# EAGLE board hackeeg-shield (EAGLE 9.6.2)
PCB Matrix Packages
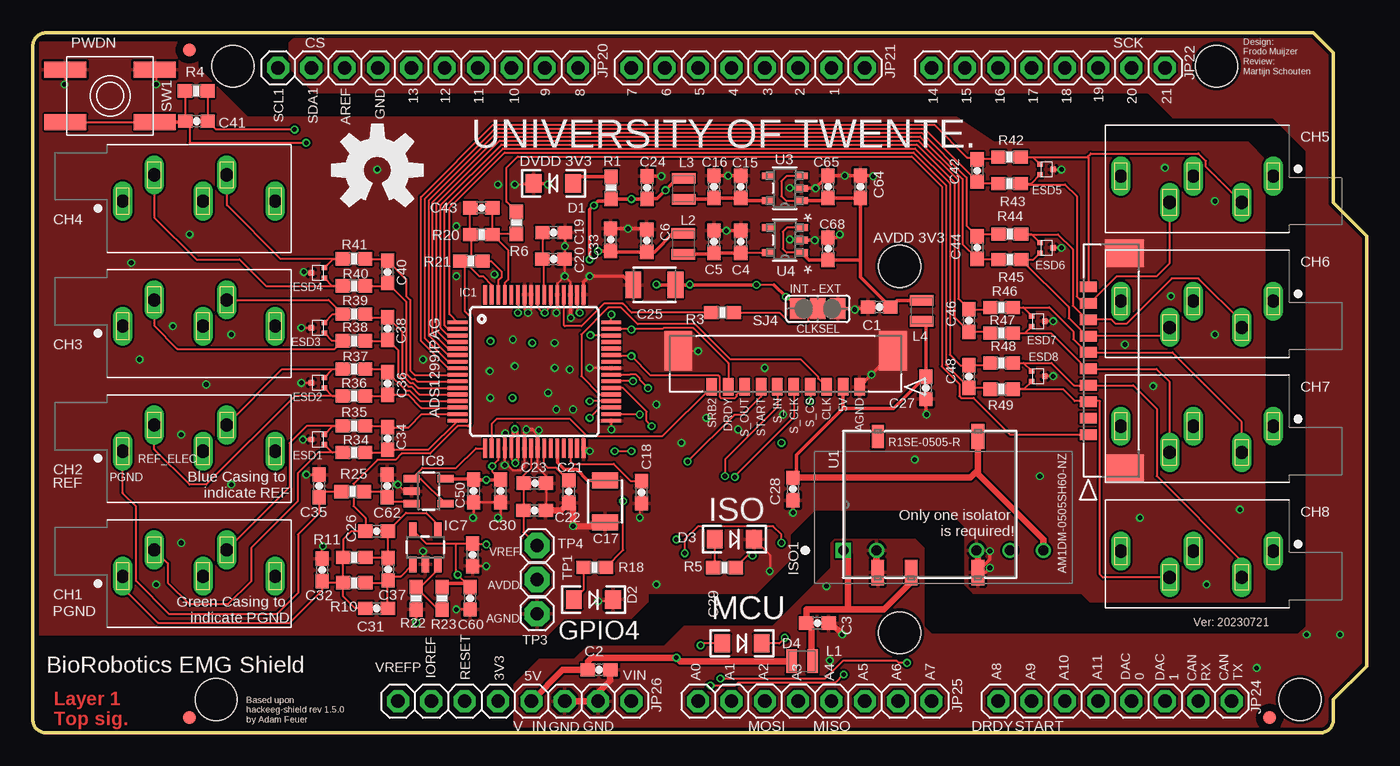
[diagram p4: board, top side]
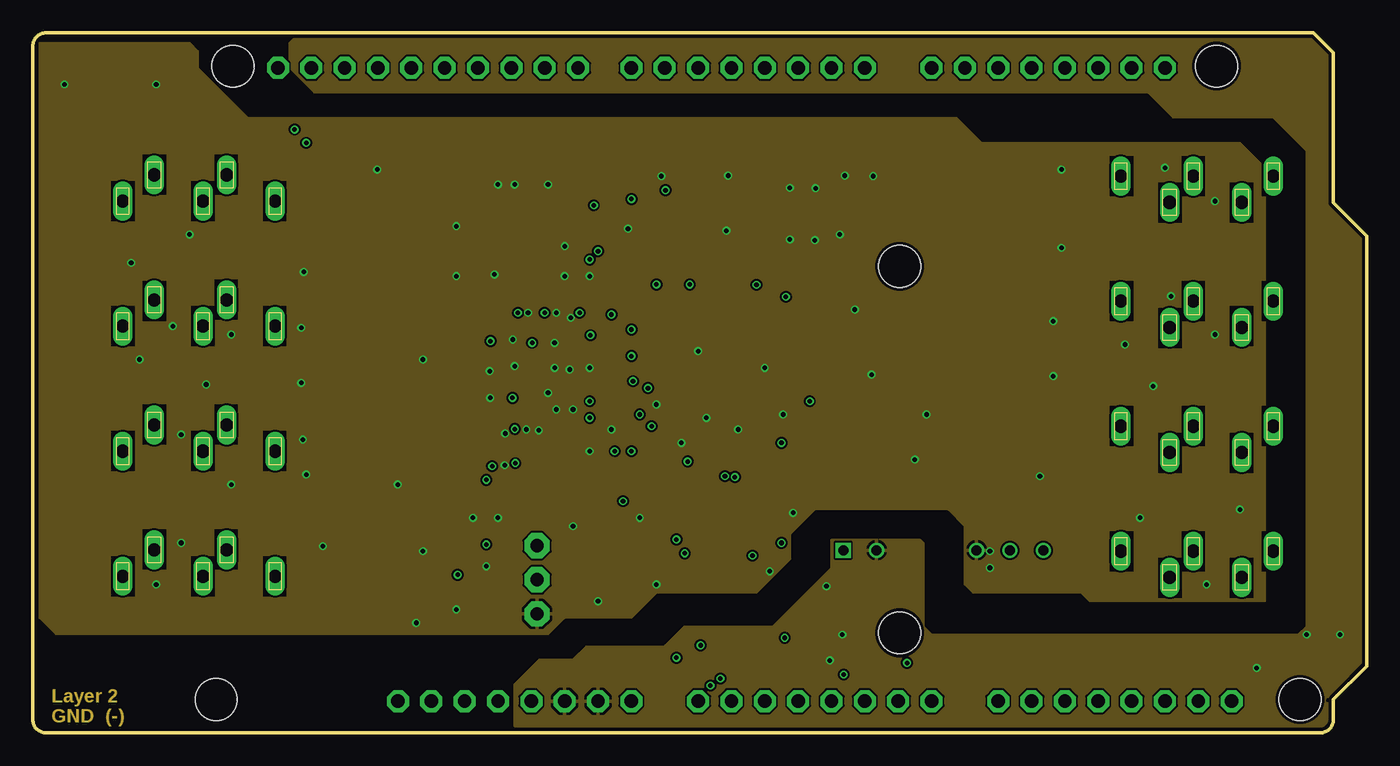
[diagram p5: board, inner layer AGND]
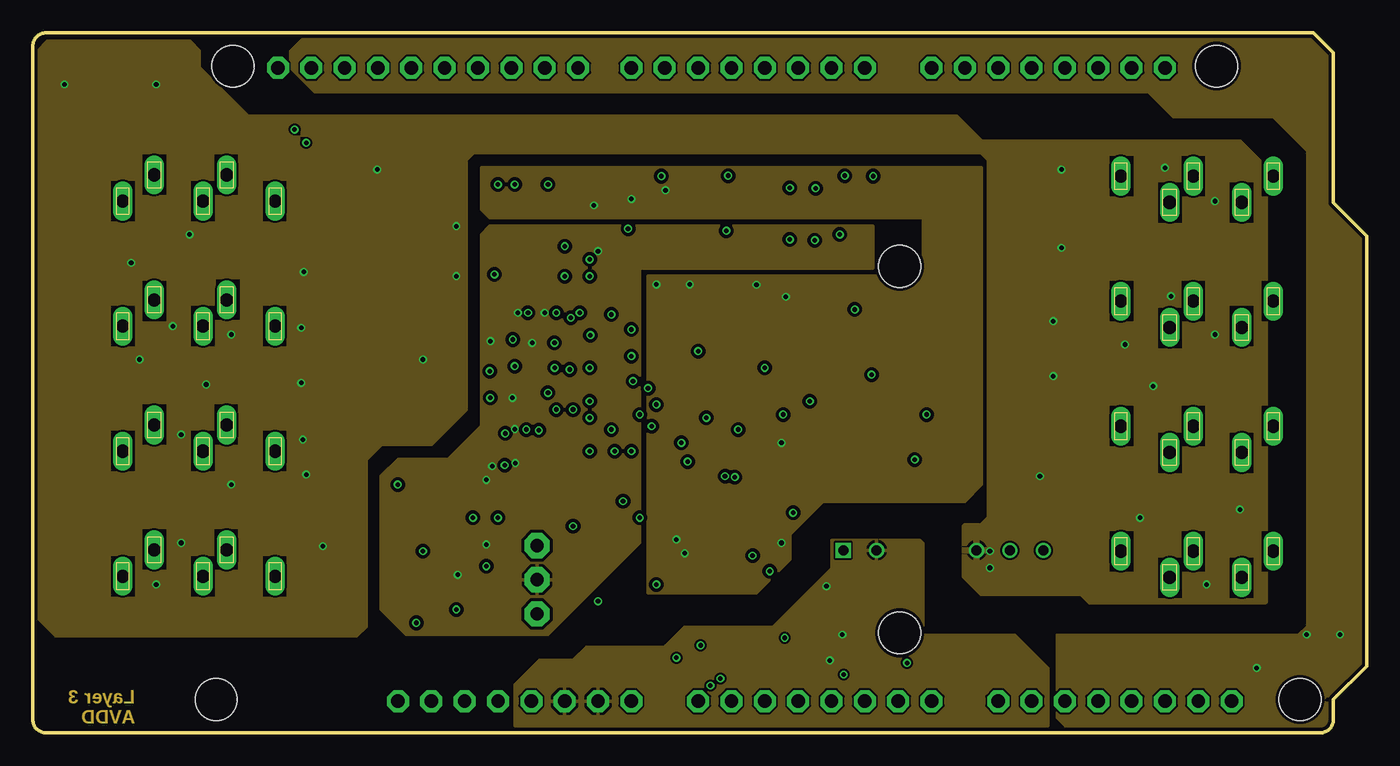
[diagram p6: board, inner layer AVDD]
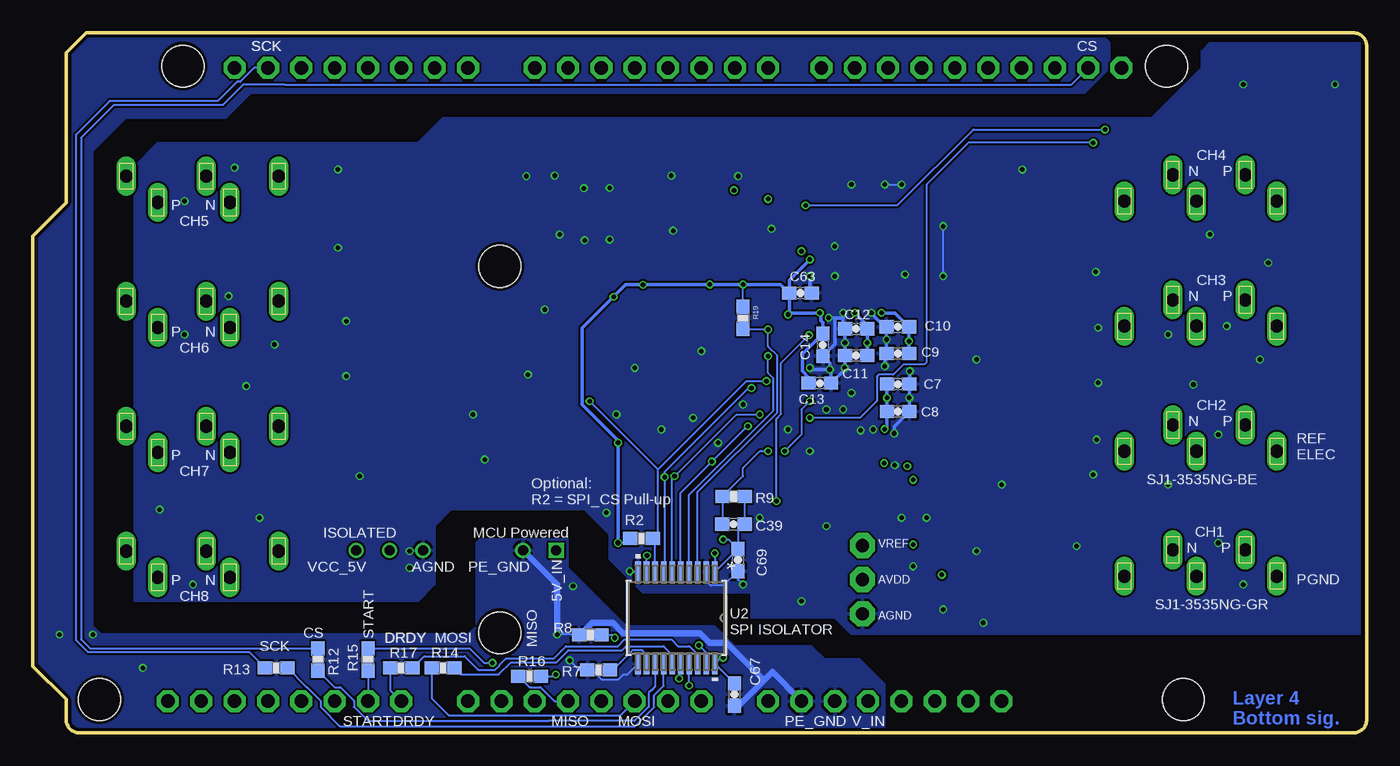
[diagram p7: board, bottom side, seen from below]

Size 101.6 x 53.34 mm. Coordinates in mm from the lower left corner, seen from the top.
Outline: 97.54,53.34 99.06,51.82 99.06,40.39 101.6,37.85 101.6,5.08 99.06,2.54 99.06,1 arc-90 98.06,0 1,0 arc-90 0,1 0,52.34 arc-90 1,53.34 97.54,53.34
Copper layers (1+2*15+16): Top 0.018mm / dielectric 0.36mm / AGND 0.035mm / dielectric 0.71mm / AVDD 0.035mm / dielectric 0.2mm / Bottom 0.018mm
Design rules "eC_4Layer_PClass6_BaseCopperO18-I35_eCDefault *": minimum track width 0.15mm, minimum drill 0.35mm, track to track 0.15mm, track to pad 0.15mm, pad to pad 0.15mm, via to via 0.15mm, smd to smd 0mil, copper to edge 0.25mm, drill to drill 0.35mm, minimum pad ring 0.175mm, minimum via ring 0.125mm, stop-mask expansion 0mil, vias tented up to drill 0.45mm, thermal gap 0.2mm
Holes 3.2 mm at 96.52,2.54 15.24,50.8 90.17,50.8 13.97,2.54 66.04,35.56 66.04,7.62

## Footprints (pad centres in the part's own frame; a part is rotated, then mirrored left to right if it is on the bottom)
0603-CAP = smd 1.1 x 1: 1 -0.85,0; 2 0.85,0
1210 = smd 1.2 x 2: 1 -1.6,0; 2 1.6,0
LED-1206 = smd 1.2 x 1.4: A -1.5,0; C 1.5,0
SOT-723 = smd 0.4 x 0.4: P$1 -0.4,-0.5; P$2 0.4,-0.5; P$3 0,0.5
TQFP64 = smd 1.5 x 0.285: 1 -5.85,3.75; 2 -5.85,3.25; 3 -5.85,2.75; 4 -5.85,2.25; 5 -5.85,1.75; 6 -5.85,1.25; 7 -5.85,0.75; 8 -5.85,0.25; 9 -5.85,-0.25; 10 -5.85,-0.75; 11 -5.85,-1.25; 12 -5.85,-1.75; 13 -5.85,-2.25; 14 -5.85,-2.75; 15 -5.85,-3.25; 16 -5.85,-3.75; 33 5.85,-3.75; 34 5.85,-3.25; 35 5.85,-2.75; 36 5.85,-2.25; 37 5.85,-1.75; 38 5.85,-1.25; 39 5.85,-0.75; 40 5.85,-0.25; 41 5.85,0.25; 42 5.85,0.75; 43 5.85,1.25; 44 5.85,1.75; 45 5.85,2.25; 46 5.85,2.75; 47 5.85,3.25; 48 5.85,3.75 | smd 0.285 x 1.5: 17 -3.75,-5.85; 18 -3.25,-5.85; 19 -2.75,-5.85; 20 -2.25,-5.85; 21 -1.75,-5.85; 22 -1.25,-5.85; 23 -0.75,-5.85; 24 -0.25,-5.85; 25 0.25,-5.85; 26 0.75,-5.85; 27 1.25,-5.85; 28 1.75,-5.85; 29 2.25,-5.85; 30 2.75,-5.85; 31 3.25,-5.85; 32 3.75,-5.85; 49 3.75,5.85; 50 3.25,5.85; 51 2.75,5.85; 52 2.25,5.85; 53 1.75,5.85; 54 1.25,5.85; 55 0.75,5.85; 56 0.25,5.85; 57 -0.25,5.85; 58 -0.75,5.85; 59 -1.25,5.85; 60 -1.75,5.85; 61 -2.25,5.85; 62 -2.75,5.85; 63 -3.25,5.85; 64 -3.75,5.85
SOT23-5 = smd 0.55 x 1.2: 1 -0.95,-1.3; 2 0,-1.3; 3 0.95,-1.3; 4 0.95,1.3; 5 -0.95,1.3
SIP1005W50P254L1965H1265Q7 = drill 0.76 pad 1.16 square: 1 -7.62,-2.495 | drill 0.76 pad 1.16: 2 -5.08,-2.495; 5 2.54,-2.495; 6 5.08,-2.495; 7 7.62,-2.495
CON_533981071 = smd 0.8 x 1.3: 1 0,0; 2 -1.25,0; 3 -2.5,0; 4 -3.75,0; 5 -5,0; 6 -6.25,0; 7 -7.5,0; 8 -8.75,0; 9 -10,0; 10 -11.25,0 | smd 2.1 x 3: 11 2.55,2.75; 12 -13.8,2.75
CUI_SJ1-3535N = drill 1 long: 1 0,0; 2 2.4,2; 3 7.9,2; 4 11.6,0; 5 6.1,0
1X10 = drill 1.016 pad 1.676 octagon: 1 -11.43,0; 2 -8.89,0; 3 -6.35,0; 4 -3.81,0; 5 -1.27,0; 6 1.27,0; 7 3.81,0; 8 6.35,0; 9 8.89,0; 10 11.43,0
1X08 = drill 1.016 pad 1.676 octagon: 1 -8.89,0; 2 -6.35,0; 3 -3.81,0; 4 -1.27,0; 5 1.27,0; 6 3.81,0; 7 6.35,0; 8 8.89,0
0805-WIDE = smd 0.8 x 1.8: 1 -0.8,0; 2 0.8,0
0603-RES = smd 1.1 x 1: 1 -0.85,0; 2 0.85,0
SJ_2 = smd 1.168 x 1.6: 1 -1.524,0; 2 0,0; 3 1.524,0
EVQ-Q2 = smd 3.2 x 1.2: A -3.4,-2; A' 3.4,-2; B -3.4,2; B' 3.4,2
1X01 = drill 1.016 pad 1.93 octagon: 1 0,0
R1SE-0505-R_RCP = smd 1.93 x 0.965: 1 -5.182,3.962; 2 -5.182,1.422; 4 -5.182,-3.658; 5 5.182,-3.658 | smd 1.778 x 0.914: 8 5.182,3.962
21-0056C_20_MXM = smd 1.613 x 0.432: 1 -3.499,2.925; 2 -3.499,2.275; 3 -3.499,1.625; 4 -3.499,0.975; 5 -3.499,0.325; 6 -3.499,-0.325; 7 -3.499,-0.975; 8 -3.499,-1.625; 9 -3.499,-2.275; 10 -3.499,-2.925; 11 3.499,-2.925; 12 3.499,-2.275; 13 3.499,-1.625; 14 3.499,-0.975; 15 3.499,-0.325; 16 3.499,0.325; 17 3.499,0.975; 18 3.499,1.625; 19 3.499,2.275; 20 3.499,2.925
UJ_5_ADI = smd 0.953 x 0.508: 1 -1.276,0.95; 2 -1.276,0; 3 -1.276,-0.95; 4 1.276,-0.95; 5 1.276,0.95
FIDUCIAL_1MM = smd 1 x 1: 1 0,0

## Placement (x,y rotation side)
C1  10uF  [0603-CAP]  64.47,32.44 180 top
C2  4.7uF  [0603-CAP]  43.13,4.81 0 top
C3  4.7uF  [0603-CAP]  59.76,8.36 0 top
C4  1uF  [0603-CAP]  53.92,37.41 90 top
C5  10 uF  [0603-CAP]  51.89,37.41 90 top
C6  10uF  [0603-CAP]  46.76,37.49 90 top
C7  1uF  [0603-CAP]  35.69,26.57 0 bottom
C8  0.1uF  [0603-CAP]  35.69,24.49 0 bottom
C9  1uF  [0603-CAP]  35.71,28.91 180 bottom
C10  0.1uF  [0603-CAP]  35.71,30.94 180 bottom
C11  1uF  [0603-CAP]  38.89,28.75 180 bottom
C12  0.1uF  [0603-CAP]  38.89,30.78 180 bottom
C13  1uF  [0603-CAP]  41.66,26.64 0 bottom
C14  0.1uF  [0603-CAP]  41.43,29.57 270 bottom
C15  1uF  [0603-CAP]  53.92,41.61 90 top
C16  10 uF  [0603-CAP]  51.89,41.61 90 top
C17  100uF  [1210]  43.59,17.63 270 top
C18  1uF  [0603-CAP]  46.35,18.34 270 top
C19  1uF  [0603-CAP]  39.67,38.13 0 top
C20  0.1uF  [0603-CAP]  39.65,36.09 0 top
C21  1uF  [0603-CAP]  40.82,18.38 270 top
C22  10uF  [0603-CAP]  38.22,16.94 0 top
C23  0.1uF  [0603-CAP]  38.24,19.02 0 top
C24  10uF  [0603-CAP]  46.79,41.55 90 top
C25  100uF  [1210]  47.35,34.14 180 top
C26  10pF  [0603-CAP]  26.19,15.37 0 top
C27  10uF  [0603-CAP]  68.02,26.29 270 top
C28  10uF  [0603-CAP]  57.89,18.57 270 top
C29  100nF  [0603-CAP]  33.5,13.56 270 top
C30  100nF  [0603-CAP]  35.62,18.43 90 top
C31  10pF  [0603-CAP]  26.19,9.49 0 top
C32  100pF  [0603-CAP]  22.03,12.42 270 top
C33  0.1uF  [0603-CAP]  44.02,37.57 90 top
C34  NC  [0603-CAP]  27.03,22.43 90 top
C35  1 pF TVS  [0603-CAP]  21.82,18.82 90 top
C36  NC  [0603-CAP]  27.03,26.62 90 top
C37  220pF  [0603-CAP]  27.06,12.47 90 top
C38  NC  [0603-CAP]  27.03,30.81 90 top
C39  100nF  [0603-CAP]  48.24,15.9 0 bottom
C40  NC  [0603-CAP]  27.03,35.13 90 top
C41  100nF  [0603-CAP]  12.47,46.6 0 top
C42  NC  [0603-CAP]  71.93,42.85 270 top
C43  NC  [0603-CAP]  34.16,40 0 top
C44  NC  [0603-CAP]  71.93,36.98 270 top
C46  NC  [0603-CAP]  71.3,31.42 270 top
C48  NC  [0603-CAP]  71.3,27.15 270 top
C50  1uF  [0603-CAP]  33.58,18.43 270 top
C60  1uF  [0603-CAP]  33.3,10.26 270 top
C62  NC  [0603-CAP]  26.98,18.82 90 top
C63  0.1uF  [0603-CAP]  43.13,33.5 0 bottom
C64  10uF  [0603-CAP]  63.04,41.61 90 top
C65  1uF  [0603-CAP]  60.58,41.61 90 top
C67  0.1uF  [0603-CAP]  48.15,2.92 270 bottom
C68  1uF  [0603-CAP]  60.58,36.88 90 top
C69  0.1uF  [0603-CAP]  47.9,13.16 270 bottom
D1  GREEN  [LED-1206]  39.65,41.86 180 top
D2  ORANGE  [LED-1206]  42.7,10.16 0 top
D3  BLUE  [LED-1206]  53.43,14.76 0 top
D4  BLUE  [LED-1206]  54.02,6.82 0 top
ESD1  ESD7L  [SOT-723]  21.71,22.35 90 top
ESD2  ESD7L  [SOT-723]  21.71,26.67 90 top
ESD3  ESD7L  [SOT-723]  21.71,30.86 90 top
ESD4  ESD7L  [SOT-723]  21.71,35.05 90 top
ESD5  ESD7L  [SOT-723]  77.22,42.93 270 top
ESD6  ESD7L  [SOT-723]  77.22,36.96 270 top
ESD7  ESD7L  [SOT-723]  76.58,31.37 270 top
ESD8  ESD7L  [SOT-723]  76.58,27.18 270 top
IC1  ADS1299IPAG  [TQFP64]  38.2,27.53 0 top
IC7  OPA376DBV  [SOT23-5]  29.9,14.15 0 top
IC8  OPA376DBV  [SOT23-5]  30.15,18.42 270 top
ISO1  AM1DM-0505SH60-NZ  [SIP1005W50P254L1965H1265Q7]  69.35,16.41 0 top
J1  533981071  [CON_533981071]  62.97,26.37 0 top
J2  SJ1-3535N  [CUI_SJ1-3535N]  6.86,11.94 0 top
J3  SJ1-3535N  [CUI_SJ1-3535N]  6.86,21.46 0 top
J4  SJ1-3535N  [CUI_SJ1-3535N]  6.86,30.99 0 top
J5  SJ1-3535N  [CUI_SJ1-3535N]  6.86,40.51 0 top
J6  SJ1-3535N  [CUI_SJ1-3535N]  94.49,42.42 180 top
J7  SJ1-3535N  [CUI_SJ1-3535N]  94.49,32.89 180 top
J8  SJ1-3535N  [CUI_SJ1-3535N]  94.49,23.37 180 top
J9  SJ1-3535N  [CUI_SJ1-3535N]  94.49,13.84 180 top
J11  533981071  [CON_533981071]  80.39,22.73 270 top
JP20  PWMH  [1X10]  30.1,50.67 0 top
JP21  PWML  [1X08]  54.48,50.67 0 top
JP22  COMMUNICATION  [1X08]  77.34,50.67 0 top
JP24  ADCH  [1X08]  82.42,2.41 0 top
JP25  ADCL  [1X08]  59.56,2.41 0 top
JP26  POWER  [1X08]  36.7,2.41 0 top
L1  6.8μH  [0805-WIDE]  58.59,5.46 0 top
L2  3.3μH  [0805-WIDE]  49.56,37.26 90 top
L3  3.3μH  [0805-WIDE]  49.58,41.45 90 top
L4  3.3μH  [0805-WIDE]  67.72,32.16 90 top
R1  270  [0603-RES]  44.04,41.53 90 top
R2  10k  [0603-RES]  55.23,14.81 0 bottom
R3  10k  [0603-RES]  52.52,32.02 0 top
R4  10k  [0603-RES]  12.44,48.91 0 top
R5  270  [0603-RES]  52.69,12.59 180 top
R6  4.99k  [0603-RES]  36.83,38.86 270 top
R7  1k  [0603-RES]  58.5,4.81 0 bottom
R8  270  [0603-RES]  59.14,7.48 0 bottom
R9  10k  [0603-RES]  48.21,18.01 0 bottom
R10  4.99k  [0603-RES]  24.49,11.44 180 top
R11  4.99k  [0603-RES]  24.49,13.38 180 top
R12  0R  [0603-RES]  79.88,5.59 270 bottom
R13  0R  [0603-RES]  83.06,4.95 0 bottom
R14  0R  [0603-RES]  70.36,4.95 0 bottom
R15  0R  [0603-RES]  76.07,5.59 90 bottom
R16  0R  [0603-RES]  63.75,4.32 0 bottom
R17  0R  [0603-RES]  73.53,4.95 0 bottom
R18  270  [0603-RES]  42.8,12.62 180 top
R19  10k  [0603-RES]  47.5,31.62 270 bottom
R20  NC  [0603-RES]  34.16,37.97 180 top
R21  NC  [0603-RES]  33.4,35.94 180 top
R22  2M  [0603-RES]  29.18,10.25 270 top
R23  2M  [0603-RES]  31.17,10.25 270 top
R25  4.99k  [0603-RES]  24.36,18.38 180 top
R34  4.99k  [0603-RES]  24.46,21.36 0 top
R35  4.99k  [0603-RES]  24.46,23.39 0 top
R36  4.99k  [0603-RES]  24.46,25.68 0 top
R37  4.99k  [0603-RES]  24.46,27.71 0 top
R38  4.99k  [0603-RES]  24.46,29.87 0 top
R39  4.99k  [0603-RES]  24.46,31.9 0 top
R40  4.99k  [0603-RES]  24.46,34.06 0 top
R41  4.99k  [0603-RES]  24.46,36.12 0 top
R42  4.99k  [0603-RES]  74.4,43.87 180 top
R43  4.99k  [0603-RES]  74.4,41.86 180 top
R44  4.99k  [0603-RES]  74.42,38 180 top
R45  4.99k  [0603-RES]  74.42,36.07 180 top
R46  4.99k  [0603-RES]  73.79,32.41 180 top
R47  4.99k  [0603-RES]  73.79,30.45 180 top
R48  4.99k  [0603-RES]  73.79,28.19 180 top
R49  4.99k  [0603-RES]  73.79,26.19 180 top
SJ4  CLK_SEL  [SJ_2]  59.79,32.31 0 top
SW1  SPST_TACT-EVQQ2  [EVQ-Q2]  5.88,48.54 0 top
TP1  AVDD_TEST_POINT  [1X01]  38.4,11.67 0 top
TP3  AGND_TEST_POINT  [1X01]  38.4,9.07 0 top
TP4  VREFP_TEST_POINT  [1X01]  38.4,14.26 0 top
U1  R1SE-0505-R  [R1SE-0505-R_RCP]  68.33,17.4 90 top
U2  MAX14483AAP+  [21-0056C_20_MXM]  52.58,8.76 270 bottom
U3  ADP151AUJZ-3.3  [UJ_5_ADI]  57.28,41.5 180 top
U4  ADP151AUJZ-3.3  [UJ_5_ADI]  57.29,37.54 180 top
U$1  [OSHW-LOGO-L]  26.24,42.88 0 top
U$2  FIDUCIAL  [FIDUCIAL_1MM]  11.91,1.17 0 top
U$5  FIDUCIAL  [FIDUCIAL_1MM]  11.91,52.04 0 top
U$6  FIDUCIAL  [FIDUCIAL_1MM]  94.21,1.17 0 top

## Tracks (layer width: path | path; a pad name or v marks a point on that pad's centre or on a via)
!PWDN  (via drill 0.35)
  Top 0.15: R4.1 11.59,46.57 11.55,46.53 | SW1.A 9.4,46.53 | v42.42,24 43.2,24.78 IC1.35 | C41.1 11.94,46.28 11.94,44.96 v20.83,44.96
  Top 0.254: C41.1 11.55,46.53 9.4,46.53 SW1.A'
  Bottom 0.15: v20.83,44.96 30.35,44.96 33.53,41.78 33.53,28.24 33.68,28.08 35.27,28.08 36.06,27.29 37.18,27.29 37.31,27.16 37.31,25.3 38.61,24 v42.42,24
!RESET  (via drill 0.35)
  Top 0.15: IC1.36 42.43,25.28 v42.42,25.27 | v44.32,21.46 v45.59,21.46
  Bottom 0.15: C39.1 49.09,17.99 R9.1 47.5,19.58 47.5,20.19 46.23,21.46 v45.59,21.46 | v42.42,25.27 43.05,24.64 43.05,22.73 v44.32,21.46
!SPI_CS  (via drill 0.35)
  Top 0.15: v45.72,26.8 44.06,26.8 IC1.39 | J1.4 59.21,25.31 v59.18,25.27
  Bottom 0.15: U2.8 54.2,14.64 R2.2 54,15.19 54,20.04 | v45.72,26.8 47.24,26.8 54,20.04 | v59.18,25.27 54,20.09 54,20.04
AGND  (via drill 0.35)
  Top 0.15: IC1.25 38.45,20.22 39.09,19.58 C23.2 39.09,16.96 C22.2 | SW1.B' 9.4,50.42 v9.4,49.4 | ESD4.P$3 20.7,35.05 v20.64,35.11 | ESD3.P$3 v20.45,30.86 | v20.45,30.86 | ESD2.P$3 v20.45,26.67 | v20.45,26.67 | C35.2 20.84,19.67 v20.83,19.69 | C62.2 27.73,18.92 v27.8,18.92 28.31,18.42 IC8.2 | v33.53,16.38 33.58,16.43 C50.2 C30.1 35.62,16.58 v35.43,16.38 | IC1.20 v35.95,20.41 v35.94,20.4 | IC1.32 42.2,21.68 v42.42,21.46 | IC1.33 44.05,23.13 v44.07,23.11 | IC1.41 42.45,27.78 v42.42,27.81 | IC1.51 40.95,34.36 v40.51,34.8 | C20.2 40.51,36.08 | 40.51,36.08 v40.51,34.8 | IC1.53 39.95,34.24 v40.51,34.8 | IC1.58 37.45,32.27 v37.72,32 37.95,32.24 IC1.57 | C29.2 34.53,12.71 v34.54,12.7 | C60.2 33.29,9.4 v32.26,9.4 | v29.2,8.38 29.19,8.4 R22.2 | C32.1 22.03,14.16 v22.1,14.22 | D3.C 56.13,13.56 v56.13,12.32 | SW1.B 2.49,49.47 v2.41,49.4 | C19.2 40.52,37.34 | v40.52,37.08 40.52,36.09 40.51,36.08 | J1.11 65.52,29.08 | J1.12 50.64,29.12 v50.67,29.08 | D2.C 44.07,10.03 v43.05,10.03 | v77.72,27.18 | v77.72,27.18 ESD8.P$3 | ESD7.P$3 v77.72,31.37 | v77.72,31.37 | ESD6.P$3 v78.36,36.96 | v78.36,36.96 | ESD5.P$3 v78.36,42.93 | v78.36,42.93
  Top 0.152: IC7.2 29.72,13.02 v29.72,13.84 | C18.2 46.23,17.36 v46.23,16.38 | ESD1.P$3 v20.57,22.35 | v20.57,22.35 | v35.94,20.4 36.16,20.4 36.53,20.03 37.17,20.03 37.45,20.31 IC1.23 | D1.C 38.07,41.78 v36.7,41.78
  Top 0.254: v72.9,13.84 72.9,13.21 71.98,12.29 U1.4 72.54,12.22 v72.9,12.57 | 65.52,29.08 65.52,28.92 v63.89,27.3 J1.1 | C28.2 57.89,16.78 v57.91,16.76 | IC1.20 35.95,22.78 v35.98,22.82 | IC1.23 37.45,22.97 v37.59,23.11 38.05,23.11 38.32,22.84 | IC1.25 38.45,22.71 38.32,22.84 | 38.32,22.84 v38.54,23.05 | IC1.53 39.95,32.08 v39.88,32 | IC1.51 40.95,31.65 v40.98,31.62 | IC1.49 41.95,34.33 v42.42,34.8 44.96,34.8 45.62,34.14 C25.2 | SJ4.3 62.55,32.31 | 62.55,32.31 v62.61,32.26 | v59.56,37.54 U4.2 57.71,37.54 v57.66,37.59 | C5.2 v52.83,38.26 C4.2 | C1.2 63.49,32.31 62.55,32.31 | C27.2 68.02,24.31 v68.07,24.26 | C68.2 61.23,37.73 v61.47,37.97 | C33.2 v45.34,38.42 46.68,38.42 C6.2 | 40.52,37.34 v40.52,37.08 | C16.2 v52.96,42.45 C15.2 | v64.01,42.42 63.97,42.45 C64.2 v61.85,42.45 C65.2 v59.62,41.5 U3.2 57.69,41.5 v57.66,41.53 | C24.2 46.8,42.42 v47.88,42.42 | D1.C 39.17,41.86 v39.24,41.78
  Top 0.508: U1.4 71.98,13.82 ISO1.5 | C17.2 43.31,15.75 v41.15,15.75 41.15,17.21 C21.2 40.23,16.94 C22.2
  Bottom 0.15: U2.10 56.08,12.26 v56.13,12.32 | C69.2 47.9,11.7 v47.5,11.3
  Bottom 0.152: C69.2 48.98,11.23 49.96,11.23 50.3,11.57 U2.2 | v36.7,41.78 v35.43,41.78 | v32.26,34.8 v32.26,38.61
  Bottom 0.254: v35.98,22.82 35.98,23.34 C8.2 v34.84,25.53 C7.2 34.8,26.61 v34.8,27.56 | v37.72,32 37.53,31.82 37.53,31.77 36.71,30.94 C10.2 v36.56,29.97 C9.2 36.7,28.77 v36.7,27.94 | v39.88,32 39.88,31.62 | 39.88,31.62 39.88,30.93 C12.2 v39.74,29.72 C11.2 39.74,27.83 v39.75,27.81 39.75,27.7 C13.2 40.81,27.6 v40.89,27.69 | v40.98,31.62 40.51,31.62 | 40.51,31.62 39.88,31.62 | 39.88,31.62 | v40.89,27.69 40.89,28.18 C14.2 40.51,29.63 40.51,31.62 | v42.42,27.81 42.29,27.69 v40.89,27.69 | v42.42,34.8 42.42,33.64 C63.2
  other vias: 86.69,33.27 91.95,17.02 35.16,34.92 11.94,37.97 11.3,22.73 15.11,18.92 11.3,14.48 9.4,11.3 13.21,26.54 15.11,30.35 10.67,30.99 55.75,27.81 86.23,43.05 90.04,40.51 90.04,30.35 83.19,29.59 89.41,11.3 47.5,25.02 76.71,19.56 84.33,16.38 67.18,20.83 26.24,42.93 29.72,28.45 39.24,25.91 39.88,24.64 41.15,24.64 51.31,24 49.4,22.1 8.13,28.45 7.49,35.81 85.34,26.42 53.72,23.11 57.15,24.26
  pour Top: 0.51,52.58 0.51,7.49 39.24,7.49 40.51,8.76 45.59,8.76 46.86,10.03 46.86,10.67 55.12,10.67 57.66,13.21 57.66,15.11 59.56,17.02 69.72,17.02 70.99,15.75 70.99,11.3 71.63,10.67 79.88,10.67 80.52,10.03 93.85,10.03 93.85,43.69 92.58,44.96 73.22,44.96 70.36,46.86 16.38,46.86 12.57,50.67 12.57,51.94 11.94,52.58
  pour Bottom: 0.51,52.58 0.51,7.49 39.24,7.49 40.51,8.76 46.86,8.76 46.86,10.67 55.12,10.67 57.66,13.21 57.66,15.11 59.56,17.02 69.72,17.02 70.99,15.75 70.99,11.3 72.26,10.03 93.85,10.03 93.85,43.18 92.08,44.96 72.26,44.96 70.36,46.86 16.38,46.86 12.57,50.67 12.57,51.94 11.94,52.58
  pour AGND: 0.51,52.58 11.94,52.58 12.57,51.94 12.57,50.67 16.38,46.86 70.36,46.86 72.26,44.96 91.95,44.96 93.85,43.05 93.85,10.03 80.52,10.03 79.88,10.67 71.63,10.67 70.99,11.3 70.99,15.75 69.72,17.02 59.56,17.02 57.66,15.11 57.66,13.21 55.12,10.67 47.5,10.67 45.59,8.76 40.51,8.76 39.24,7.49 1.78,7.49 0.51,8.76
  pour AVDD: 24.64,7.49 25.27,8.13 25.27,9.4 25.27,20.83 26.54,22.1 27.18,22.1 30.35,22.1 32.26,24 32.89,24.64 32.89,43.69 33.53,44.32 39.24,44.32 72.26,44.32 72.9,43.69 72.9,16.38 72.26,15.75 70.99,15.75 70.99,11.94 72.26,10.67 78.61,10.67 79.88,10.67 80.52,10.03 81.15,10.03 93.85,10.03 93.85,43.05 91.95,44.96 72.26,44.96 70.36,46.86 68.45,46.86 17.02,46.86 16.38,46.86 12.57,50.67 12.57,51.94 11.94,52.58 11.3,52.58 1.14,52.58 0.51,51.94 0.51,50.67 0.51,8.76 1.78,7.49
AIN1N
  Top 0.152: R35.2 26.91,23.39 C34.2 28.61,23.28 29.62,24.28 IC1.15
AIN1P
  Top 0.152: R34.2 26.81,21.36 C34.1 30.15,21.58 IC1.16
AIN2N
  Top 0.152: R37.2 26.78,27.71 C36.2 28.42,26.07 28.71,26.07 29.5,25.28 IC1.13
AIN2P
  Top 0.152: R36.2 26.94,25.68 C36.1 28.59,25.77 29.59,24.77 32.33,24.77 IC1.14
AIN3N
  Top 0.152: R39.2 25.55,31.66 C38.2 28.12,30.57 28.12,27.3 28.74,26.68 28.96,26.68 29.35,26.29 IC1.11
AIN3P
  Top 0.152: R38.2 26.94,29.87 C38.1 27.81,29.17 27.81,27.18 28.62,26.37 28.84,26.37 29.43,25.78 IC1.12
AIN4N
  Top 0.152: R41.2 26.89,36.12 C40.2 28.45,34.56 28.45,33.28 28.75,32.98 28.75,27.61 29.08,27.28 IC1.9
AIN4P
  Top 0.152: R40.2 26.81,34.06 C40.1 28.45,32.86 28.45,27.4 28.87,26.98 29.09,26.98 29.28,26.78 IC1.10
AIN5N
  Top 0.152: R43.2 72.07,41.86 C42.2 67.9,46.03 35.19,46.03 29.86,40.7 29.86,30.06 31.64,28.28 IC1.7
AIN5P
  Top 0.152: R42.2 73.38,43.7 C42.1 71.79,43.85 71.15,43.85 68.66,46.34 35.07,46.34 29.56,40.83 29.56,29.86 31.64,27.78 IC1.8
AIN6N
  Top 0.152: IC1.5 31.64,29.28 30.47,30.46 30.47,40.45 35.44,45.43 67.58,45.43 70.82,42.19 70.82,37.25 C44.2 72,36.07 R45.2
AIN6P
  Top 0.152: R44.2 72.1,38 C44.1 71.12,38.64 71.12,42.32 67.71,45.73 35.32,45.73 30.17,40.58 30.17,30.26 31.64,28.78 IC1.6
AIN7N
  Top 0.152: R47.2 72.82,30.57 C46.2 70.18,31.69 70.18,41.97 67.33,44.82 35.69,44.82 31.07,40.2 31.07,30.85 31.64,30.28 IC1.3
AIN7P
  Top 0.152: R46.2 72.8,32.27 C46.1 70.48,33.08 70.48,42.1 67.46,45.12 35.57,45.12 30.77,40.33 30.77,30.65 31.64,29.78 IC1.4
AIN8N
  Top 0.152: R49.2 72.82,26.3 C48.2 69.55,28.05 69.55,41.75 67.08,44.22 35.94,44.22 31.73,40.01 31.73,31.9 IC1.1
AIN8P
  Top 0.152: R48.2 72.75,28 C48.1 70.66,28 69.85,28.82 69.85,41.88 67.21,44.52 35.82,44.52 31.38,40.08 31.38,31.05 31.64,30.78 IC1.2
AVDD  (via drill 0.35)
  Top 0.15: C30.2 34.99,19.91 v34.99,20.32 35.45,20.78 IC1.19 | IC1.21 36.45,20.85 v36.75,20.55 36.95,20.76 IC1.22 | IC1.54 39.45,32.47 v38.99,32 38.86,32 38.45,32.41 IC1.56 | IC1.59 v36.95,32.01 v36.96,32 | 32.26,14.41 C29.1 34.48,14.41 v34.54,14.35
  Top 0.152: IC7.5 29.98,14.41 32.26,14.41 32.26,12.15 v32.36,12.04 | v32.36,12.04 33,11.41 C60.1 v32.36,12.04
  Top 0.254: IC1.21 36.45,22.47 36.56,22.58 36.56,22.99 v36.71,23.15 36.89,22.97 36.89,22.62 36.95,22.56 IC1.22 | v43.05,36.7 44,36.7 C33.1 44.09,36.64 C6.1 47.35,36.64 48.78,38.06 L2.2 | R23.1 31.48,11.41 33,11.41 | C30.2 v34.54,19.28 C50.1 33.49,19.37 IC8.5
  Bottom 0.15: 34.86,29.72 v34.86,29.85 | 36.54,25.27 v36.54,25.53
  Bottom 0.254: 36.54,25.27 C8.1 36.54,23.33 v36.71,23.15 | v36.54,25.53 C7.1 | v36.96,32 35.93,32 C10.1 v34.86,29.85 | C9.1 34.86,29.72 | v38.99,32 38.04,31.05 C12.1 v38.04,29.72 C11.1
  pour AVDD (isolate 0.254): 34.8,38.61 34.16,37.97 34.16,23.37 31.62,20.83 27.81,20.83 26.54,19.56 26.54,9.4 28.45,7.49 39.24,7.49 46.23,14.48 46.23,35.43 64.01,35.43 64.01,38.61
BIASINV
  Top 0.152: R20.1 36.21,36.78 36.21,34.53 35.95,34.27 IC1.61 | R20.1 C43.2 | R20.1 35.05,38.01 R6.2
CLK
  Top 0.15: J1.3 59.84,27 59.84,27.11 58.51,28.45 53.13,28.45 50.43,31.14 46.07,31.14 44.81,32.4 43.83,32.4 41.78,30.35 41.78,27.18 43.18,25.78 IC1.37
CLKSEL
  Top 0.15: R3.1 45.62,32.02 44.94,32.7 43.5,32.7 41.78,30.99 40.51,30.99 40.45,31.05 IC1.52
DRDY  (via drill 0.35)
  Top 0.15: v45.59,30.73 45.54,30.78 | 45.54,30.78 IC1.47 | 45.54,30.78 47.96,30.78 48.02,30.85 50.31,30.85 52.97,28.18 52.97,26.38 J1.9
  Bottom 0.15: U2.3 51,12.31 51,18.32 44.89,24.42 44.89,28.75 45.59,29.44 v45.59,30.73
  Bottom 0.152: R19.2 45.63,30.77 v45.59,30.73
DRDY_D69
  Bottom 0.152: R17.1 74.38,3.26 JP24.1
DVDD  (via drill 0.35)
  Top 0.15: IC1.48 44.05,31.86 v44.07,31.88 | IC1.50 41.45,32.21 v41.66,32 | R4.2 13.32,48.88 C41.2 13.96,45.97 v19.93,45.97 v19.94,45.97 | v57.02,14.48 57.02,15.11 56.39,15.75 50.67,15.75 49.66,14.73 v49.66,13.68 | 56.44,34.14 v55.12,34.14 | SJ4.1 v57.36,33.23
  Top 0.254: v47.5,34.16 47.52,34.14 C25.1 v55.12,34.14 | v57.36,33.23 56.44,34.14 | L3.2 49.1,42.25 v48.19,41.34 47.55,40.7 C24.1 46.76,40.68 v45.59,40.68 R1.1 43.88,40.51 43.05,40.51 v42.73,40.2 42.42,39.88 v42.42,36.07
  Bottom 0.15: R2.1 56.42,14.48 v57.02,14.48 | C69.1 U2.1 v49.66,13.68 | C69.1 48.62,14.73 v49.02,14.73 | R9.2 47.39,17.99 C39.2 47.9,15.39 C69.1 | v42.73,40.2 35.75,40.2 29.97,45.97 v19.94,45.97
  Bottom 0.152: R19.1 v47.5,34.16
  Bottom 0.254: 43.94,32 v41.66,32 41.55,31.9 41.55,31.38 41.43,31.26 C14.1 42.99,28.85 42.99,27.57 42.51,27.09 C13.1 | 43.94,32 v44.07,31.88 | C63.1 43.98,32.04 43.94,32 | C63.1 44.64,34.16 v47.5,34.16 v50.04,34.16 56.44,34.16 59.76,30.85 59.76,25.03 57.02,22.3 v57.02,22.1 v57.02,14.48 | v42.42,36.07 43.98,34.51 C63.1
  pour AVDD (isolate 0.254): 34.16,39.88 34.16,43.05 72.26,43.05 72.26,18.92 70.99,17.65 60.2,17.65 57.66,15.11 57.66,13.21 55.12,10.67 46.86,10.67 46.86,34.8 67.82,34.8 67.82,39.24 34.8,39.24
GPIO4  (via drill 0.35)
  Top 0.15: R18.1 44.96,13.93 v44.96,17.65 | v42.47,30.3 44.04,30.3 IC1.46
  Bottom 0.15: v44.96,17.65 44.96,23.94 44.59,24.3 44.59,28.18 v42.47,30.3
IN1N
  Top 0.152: ESD1.P$2 22.86,23.39 R35.1 23.59,23.37 20.85,23.37 19.56,22.08 19.56,18.74 J2.3
IN1P
  Top 0.152: ESD1.P$1 22.8,21.36 R34.1 21.76,21.36 20.18,19.78 20.18,17.64 16.64,14.1 16.64,11.56 14.86,9.78 11.94,9.78 10.27,11.44 10.27,12.92 J2.2
IN2N
  Top 0.152: ESD2.P$2 22.86,27.71 R37.1 19.01,27.71 J3.3
IN2P
  Top 0.152: ESD2.P$1 22.8,25.68 R36.1 19.96,25.68 13.21,18.92 11.94,18.92 9.26,21.6 J3.2
IN3N
  Top 0.152: ESD3.P$2 22.86,31.9 R39.1 22.53,32.99 J4.3
IN3P
  Top 0.152: ESD3.P$1 22.8,29.87 R38.1 23,29.26 11.01,29.26 9.26,31.02 J4.2
IN4N
  Top 0.152: ESD4.P$2 22.88,36.12 R41.1 18.87,36.12 14.79,40.2 14.79,42.47 J5.3
IN4P
  Top 0.152: ESD4.P$1 22.8,34.06 R40.1 17.76,34.06 15.75,36.07 12.46,36.07 9.26,39.27 J5.2
IN5N
  Top 0.152: ESD5.P$2 76.05,41.86 R43.1 75.32,41.78 78.61,41.78 79.52,40.88 79.52,33.26 80.04,32.73 J11.9 80.51,32.73 82.58,34.8 85.6,34.8 86.59,35.79 J6.3
IN5P
  Top 0.152: R42.1 76.18,43.87 ESD5.P$1 | R42.1 80.39,43.87 J11.10 | R42.1 80.3,43.87 80.58,44.14 88.77,44.14 88.79,44.14 89.36,43.57 89.36,43.14 J6.2
IN6N
  Top 0.152: ESD6.P$2 76.23,36.07 R45.1 78.91,32.43 78.91,31.59 80.27,30.23 J11.7 85.93,30.23 J7.3
IN6P
  Top 0.152: ESD6.P$1 76.08,38 R44.1 75.3,37.97 78.09,37.97 79.21,36.85 79.21,32.54 80.27,31.48 J11.8 82.17,31.48 82.48,31.17 83.29,31.17 86.75,34.62 88.79,34.62 92.09,31.32 J7.2
IN7N
  Top 0.152: ESD7.P$2 75.57,30.46 R47.1 77.55,30.46 80.27,27.73 J11.5 85.59,27.73 86.59,26.74 J8.3
IN7P
  Top 0.152: ESD7.P$1 75.44,32.41 R46.1 77.43,32.41 79.25,30.59 79.25,30.01 80.27,28.98 J11.6 86.81,28.98 92.09,23.7 J8.2
IN8N
  Top 0.152: ESD8.P$2 75.49,26.19 R49.1 78.45,26.19 79.36,25.27 80.35,25.27 J11.3 80.43,25.27 81.28,25.27 81.28,12.07 81.51,11.84 J9.3
IN8P
  Top 0.152: ESD8.P$1 75.47,28.19 R48.1 77.6,28.19 79.31,26.48 J11.4 83.81,26.48 85.6,24.69 85.6,19.56 92.09,13.07 J9.2
N$1
  Top 0.15: 53.95,36.59 U4.5
  Top 0.152: 53.95,36.59 C4.1
  Top 0.254: C4.1 C5.1 51.79,36.46 L2.1
N$2
  Top 0.254: U3.5 54.13,40.55 C15.1 C16.1 51.79,40.65 L3.1
N$3
  Top 0.254: C17.1 42.27,19.23 41.44,20.06 40.5,20.06 39.95,20.61 IC1.28
N$4
  Top 0.152: IC1.30 40.95,20.69 41.15,20.5 44.24,20.5 45.54,19.19 C18.1
N$5
  Top 0.152: C19.1 38.82,36.12 C20.1 38.95,35.94 IC1.55
N$6
  Top 0.508: U1.2 66.9,11.46 64.84,9.4 62.1,9.4 | 62.1,9.4 58.91,9.4 C3.1 59.29,7.98 59.29,5.57 L1.2 | 62.1,9.4 62.1,13.54 ISO1.1
N$7  (via drill 0.35)
  Top 0.15: D4.A 51.02,6.82 v50.86,6.67
  Bottom 0.15: v50.86,6.67 50.3,6.11 U2.19
N$8
  Top 0.152: C21.1 39.86,20.19 39.24,20.19 38.95,20.48 IC1.26
N$9
  Top 0.15: D3.A 51.93,12.69 R5.2
N$10
  Top 0.152: R6.1 36.07,40.47 36.07,43.05 36.93,43.92 66.95,43.92 69.25,41.63 69.25,27.93 70.57,26.6 70.57,25.66 70.7,25.53 71.65,25.53 74.44,22.73 J11.1
N$11  (via drill 0.35)
  Top 0.15: v54.82,13.51 54.45,13.51 R5.1
  Bottom 0.15: U2.9 54.85,13.47 v54.82,13.51
N$12
  Bottom 0.15: 67.67,4.81 66.37,4.81 66.06,5.12 66.06,5.17 65.55,5.68 61.92,5.68 61.37,6.22
  Bottom 0.152: U2.18 50.91,5.31 50.91,5.91 51.6,6.6 52.45,6.6 52.96,7.11 56.52,7.11 57.03,6.6 60.99,6.6 61.37,6.22 | R17.2 71.79,5.84 68.71,5.84 67.82,4.95 67.67,4.81
N$13  (via drill 0.35)
  Top 0.15: v57.28,7.24 56.86,6.82 D4.C
  Bottom 0.15: R8.2 57.52,7.48 v57.28,7.24
N$14
  Top 0.15: R18.2 41.95,10.91 D2.A
N$15
  Top 0.15: R23.2 30.89,9.4 R22.1 29.51,11.1 30.85,12.43 IC7.3
N$16
  Bottom 0.15: U2.13 54.2,3.53 | 54.48,3.25 54.69,3.05 54.69,1.97 55.75,0.91 62.33,0.91
  Bottom 0.152: R12.2 78.62,3.48 78.17,3.48 77.14,2.44 77.14,1.97 76.07,0.91 62.33,0.91 | 54.2,3.53 54.48,3.25
N$17
  Bottom 0.15: R13.2 80.73,3.48 80.71,3.48 79.68,2.44 79.68,1.97 78.21,0.51 55.73,0.51 54.28,1.96 54.28,2.85 53.55,3.58 U2.14
N$18
  Top 0.152: R10.1 26.88,11.44 C37.1 | C31.2 27.04,11.6 C37.1 | C37.1 27.38,11.94 28.04,11.94 IC7.1
N$19
  Top 0.254: D1.A 41.67,42.38 R1.2
N$20
  Top 0.15: R3.2 56.86,32.02 57.59,31.29 58.95,31.29 59.08,31.42 59.08,31.6 SJ4.2
N$21
  Bottom 0.15: 66.11,4.45 65.18,5.37 61.72,5.37
  Bottom 0.152: R14.2 69,4.45 66.11,4.45 | 61.72,5.37 60.8,6.3 56.72,6.3 56.41,6.6 53.55,6.6 52.9,5.96 U2.15
N$22  (via drill 0.35)
  Top 0.15: 60.71,4.49 60.35,4.13 v52.37,4.13
  Top 0.152: v66.59,5.33 65.95,5.33 65.81,5.48 61.7,5.48 60.71,4.49
  Bottom 0.15: v52.37,4.13 52.37,5.14 U2.16
  Bottom 0.152: R15.2 68.33,6.44 67.22,5.33 v66.59,5.33
N$23  (via drill 0.35)
  Top 0.152: v61.76,4.45 61.13,3.81 53.72,3.81 53.52,3.61 v51.61,3.61
  Bottom 0.152: v51.61,3.61 51.61,4.75 51.6,4.75 U2.17 | R16.2 61.89,4.32 v61.76,4.45
N$24
  Top 0.152: C43.1 R20.2 33.37,37.92 33.37,35.43 34,34.8 34.29,34.8 34.95,34.14 IC1.63
N$25
  Top 0.152: IC1.62 35.45,34.47 35.69,34.71 35.69,35.14 34.89,35.94 R21.1
N$26
  cutout AVDD: 98.6,2.59 98.58,2.49 arc180
N$44
  Bottom 0.152: U2.12 54.85,5.96 55.19,6.3 55.91,6.3 57.4,4.81 R7.2
N$54
  Top 0.152: R11.1 27,13.38 C37.2 27.04,13.34 C26.2 28.43,16.76 29.97,16.76 30.85,15.89 IC7.4
N$55
  cutout AGND: 98.63,2.57 98.6,2.46 arc180
NC
  cutout AGND: 5.97,38.99 5.97,42.04 7.75,42.04 7.75,38.99
  cutout AVDD: 82.04,43.94 82.04,40.89 83.82,40.89 83.82,43.94
NC1
  cutout AGND: 8.38,41.02 8.38,44.07 10.16,44.07 10.16,41.02
NC2
  cutout AGND: 12.06,38.99 12.06,42.04 13.84,42.04 13.84,38.99
NC3
  cutout AGND: 13.84,41.02 13.84,44.07 15.62,44.07 15.62,41.02
NC4
  cutout AGND: 17.53,38.99 17.53,42.04 19.3,42.04 19.3,38.99
NC5
  cutout AGND: 5.97,29.46 5.97,32.51 7.75,32.51 7.75,29.46
NC6
  cutout AGND: 8.38,31.37 8.38,34.42 10.16,34.42 10.16,31.37
NC7
  cutout AGND: 12.06,29.46 12.06,32.51 13.84,32.51 13.84,29.46
NC8
  cutout AGND: 13.84,31.5 13.84,34.54 15.62,34.54 15.62,31.5
NC9
  cutout AGND: 17.53,29.46 17.53,32.51 19.3,32.51 19.3,29.46
NC10
  cutout AGND: 5.97,19.94 5.97,22.99 7.75,22.99 7.75,19.94
NC11
  cutout AGND: 8.38,21.97 8.38,25.02 10.16,25.02 10.16,21.97
NC12
  cutout AGND: 12.06,19.94 12.06,22.99 13.84,22.99 13.84,19.94
NC13
  cutout AGND: 13.84,21.97 13.84,25.02 15.62,25.02 15.62,21.97
NC14
  cutout AGND: 17.53,19.94 17.53,22.99 19.3,22.99 19.3,19.94
NC15
  cutout AGND: 5.97,10.41 5.97,13.46 7.75,13.46 7.75,10.41
NC16
  cutout AGND: 8.38,12.45 8.38,15.49 10.16,15.49 10.16,12.45
NC17
  cutout AGND: 12.06,10.41 12.06,13.46 13.84,13.46 13.84,10.41
NC18
  cutout AGND: 13.84,12.45 13.84,15.49 15.62,15.49 15.62,12.45
NC19
  cutout AGND: 17.53,10.41 17.53,13.46 19.3,13.46 19.3,10.41
NC20
  cutout AGND: 82.04,12.32 82.04,15.37 83.82,15.37 83.82,12.32
NC21
  cutout AGND: 85.73,10.29 85.73,13.33 87.5,13.33 87.5,10.29
NC22
  cutout AGND: 87.5,12.32 87.5,15.37 89.28,15.37 89.28,12.32
NC23
  cutout AGND: 91.19,10.29 91.19,13.33 92.96,13.33 92.96,10.29
NC24
  cutout AGND: 93.6,12.32 93.6,15.37 95.38,15.37 95.38,12.32
NC25
  cutout AGND: 93.6,21.84 93.6,24.89 95.38,24.89 95.38,21.84
NC26
  cutout AGND: 91.19,19.81 91.19,22.86 92.96,22.86 92.96,19.81
NC27
  cutout AGND: 87.5,21.84 87.5,24.89 89.28,24.89 89.28,21.84
NC28
  cutout AGND: 85.73,19.81 85.73,22.86 87.5,22.86 87.5,19.81
NC29
  cutout AGND: 82.04,21.84 82.04,24.89 83.82,24.89 83.82,21.84
NC30
  cutout AGND: 82.04,31.37 82.04,34.42 83.82,34.42 83.82,31.37
NC31
  cutout AGND: 85.73,29.34 85.73,32.38 87.5,32.38 87.5,29.34
NC32
  cutout AGND: 87.5,31.37 87.5,34.42 89.28,34.42 89.28,31.37
NC33
  cutout AGND: 91.19,29.46 91.19,32.51 92.96,32.51 92.96,29.46
NC34
  cutout AGND: 93.6,31.37 93.6,34.42 95.38,34.42 95.38,31.37
NC35
  cutout AGND: 82.04,40.89 82.04,43.94 83.82,43.94 83.82,40.89
NC36
  cutout AGND: 85.73,38.86 85.73,41.91 87.5,41.91 87.5,38.86
NC37
  cutout AGND: 87.5,40.89 87.5,43.94 89.28,43.94 89.28,40.89
NC38
  cutout AGND: 91.19,38.86 91.19,41.91 92.96,41.91 92.96,38.86
NC39
  cutout AGND: 93.6,40.89 93.6,43.94 95.38,43.94 95.38,40.89
NC40
  cutout AVDD: 85.73,41.91 85.73,38.86 87.5,38.86 87.5,41.91
NC41
  cutout AVDD: 87.5,43.94 87.5,40.89 89.28,40.89 89.28,43.94
NC42
  cutout AVDD: 91.19,41.91 91.19,38.86 92.96,38.86 92.96,41.91
NC43
  cutout AVDD: 93.6,43.94 93.6,40.89 95.38,40.89 95.38,43.94
NC44
  cutout AVDD: 82.04,34.42 82.04,31.37 83.82,31.37 83.82,34.42
NC45
  cutout AVDD: 85.73,32.38 85.73,29.34 87.5,29.34 87.5,32.38
NC46
  cutout AVDD: 87.5,34.42 87.5,31.37 89.28,31.37 89.28,34.42
NC47
  cutout AVDD: 91.19,32.51 91.19,29.46 92.96,29.46 92.96,32.51
NC48
  cutout AVDD: 93.6,34.42 93.6,31.37 95.38,31.37 95.38,34.42
NC49
  cutout AVDD: 82.04,24.89 82.04,21.84 83.82,21.84 83.82,24.89
NC50
  cutout AVDD: 85.73,22.86 85.73,19.81 87.5,19.81 87.5,22.86
NC51
  cutout AVDD: 87.5,24.89 87.5,21.84 89.28,21.84 89.28,24.89
NC52
  cutout AVDD: 91.19,22.86 91.19,19.81 92.96,19.81 92.96,22.86
NC53
  cutout AVDD: 93.6,24.89 93.6,21.84 95.38,21.84 95.38,24.89
NC54
  cutout AVDD: 82.04,15.37 82.04,12.32 83.82,12.32 83.82,15.37
NC55
  cutout AVDD: 85.73,13.33 85.73,10.29 87.5,10.29 87.5,13.33
NC56
  cutout AVDD: 87.5,15.37 87.5,12.32 89.28,12.32 89.28,15.37
NC57
  cutout AVDD: 91.19,13.33 91.19,10.29 92.96,10.29 92.96,13.33
NC58
  cutout AVDD: 93.6,15.37 93.6,12.32 95.38,12.32 95.38,15.37
NC59
  cutout AVDD: 5.97,13.46 5.97,10.41 7.75,10.41 7.75,13.46
NC60
  cutout AVDD: 8.38,15.49 8.38,12.45 10.16,12.45 10.16,15.49
NC61
  cutout AVDD: 12.06,13.46 12.06,10.41 13.84,10.41 13.84,13.46
NC62
  cutout AVDD: 13.84,15.49 13.84,12.45 15.62,12.45 15.62,15.49
NC63
  cutout AVDD: 17.53,13.46 17.53,10.41 19.3,10.41 19.3,13.46
NC64
  cutout AVDD: 5.97,22.99 5.97,19.94 7.75,19.94 7.75,22.99
NC65
  cutout AVDD: 8.38,25.02 8.38,21.97 10.16,21.97 10.16,25.02
NC66
  cutout AVDD: 12.06,22.99 12.06,19.94 13.84,19.94 13.84,22.99
NC67
  cutout AVDD: 13.84,25.02 13.84,21.97 15.62,21.97 15.62,25.02
NC68
  cutout AVDD: 17.53,22.99 17.53,19.94 19.3,19.94 19.3,22.99
NC69
  cutout AVDD: 5.97,32.51 5.97,29.46 7.75,29.46 7.75,32.51
NC70
  cutout AVDD: 8.38,34.42 8.38,31.37 10.16,31.37 10.16,34.42
NC71
  cutout AVDD: 12.06,32.51 12.06,29.46 13.84,29.46 13.84,32.51
NC72
  cutout AVDD: 13.97,34.54 13.97,31.5 15.75,31.5 15.75,34.54
NC73
  cutout AVDD: 17.53,32.51 17.53,29.46 19.3,29.46 19.3,32.51
NC74
  cutout AVDD: 5.97,42.04 5.97,38.99 7.75,38.99 7.75,42.04
NC75
  cutout AVDD: 8.38,44.07 8.38,41.02 10.16,41.02 10.16,44.07
NC76
  cutout AVDD: 12.06,42.04 12.06,38.99 13.84,38.99 13.84,42.04
NC77
  cutout AVDD: 13.84,44.07 13.84,41.02 15.62,41.02 15.62,44.07
NC78
  cutout AVDD: 17.53,42.04 17.53,38.99 19.3,38.99 19.3,42.04
PE  (via drill 0.35)
  Top 0.508: JP26.6 JP26.7 43.05,3.05 43.98,3.97 C2.2 | C3.2 60.79,8.36 v61.66,7.49 | U1.1 64.27,12.31 ISO1.2
  Bottom 0.15: R8.1 60,7.49 v61.66,7.49 | 57.02,4.08 56.97,4.08 56.64,4.41
  Bottom 0.152: 57.02,4.08 58.3,4.08 59.02,4.81 R7.1 60,4.81 v60.71,5.52 | U2.11 56.35,4.41 56.64,4.41
  Bottom 0.508: ISO1.2 61.66,11.3 v61.66,7.49 | R8.1 59.91,7.48 59,8.38 57.42,8.38 56.63,7.59 50.79,7.59 50.06,6.86 48.77,6.86 45.91,4 | JP26.7 45.28,4.64 45.91,4 | C67.2 47.84,2.08 45.91,4
  other vias: 93.22,4.95 99.57,7.49 97.03,7.49 60.45,11.18
  pour AVDD: 36.7,0.51 36.7,3.68 38.61,5.59 41.15,5.59 42.16,6.6 48.13,6.6 49.66,8.13 56.39,8.13 60.83,12.57 60.83,14.73 67.56,14.73 67.82,14.48 67.82,7.49 74.8,7.49 77.34,4.95 77.34,0.51 76.71,-0.13 37.34,-0.13
  pour Bottom: 36.7,0.51 36.7,3.68 38.61,5.59 41.27,5.59 42.29,6.6 48.13,6.6 49.66,8.13 56.39,8.13 60.83,12.57 60.83,14.73 67.56,14.73 67.82,14.48 67.82,8.13 68.45,7.49 96.39,7.49 97.03,8.13 97.03,44.32 94.49,46.86 86.87,46.86 84.96,48.77 21.46,48.77 19.56,50.67 19.56,52.58 20.19,53.21 97.66,53.21 98.93,51.94 98.93,40.51 101.47,37.97 101.47,5.59 98.93,3.05 98.93,1.14 97.66,-0.13 37.34,-0.13
  pour Top: 38.61,5.59 41.27,5.59 42.29,6.6 48.13,6.6 49.66,8.13 56.39,8.13 60.83,12.57 60.83,14.48 61.09,14.73 67.18,14.73 67.82,14.1 67.82,8.13 68.45,7.49 96.39,7.49 97.03,8.13 97.03,44.32 94.49,46.86 86.87,46.86 84.96,48.77 21.46,48.77 19.56,50.67 19.56,52.58 20.19,53.21 97.66,53.21 98.93,51.94 98.93,40.51 101.47,37.97 101.47,5.59 98.93,3.05 98.93,1.14 97.66,-0.13 37.34,-0.13 36.7,0.51 36.7,3.68
  pour AGND: 36.7,0.51 36.7,3.68 38.61,5.59 41.15,5.59 42.16,6.6 48.13,6.6 49.66,8.13 56.39,8.13 60.83,12.57 60.83,14.73 67.56,14.73 67.82,14.48 67.82,8.13 68.45,7.49 96.39,7.49 97.03,8.13 97.03,44.32 94.49,46.86 86.87,46.86 84.96,48.77 21.46,48.77 19.56,50.67 19.56,52.58 20.19,53.21 97.66,53.21 98.93,51.94 98.93,40.51 101.47,37.97 101.47,5.59 98.93,3.05 98.93,1.14 97.66,-0.13 37.34,-0.13
  pour AVDD: 21.46,48.77 84.96,48.77 86.87,46.86 88.77,46.86 94.49,46.86 97.03,44.32 97.03,8.13 96.39,7.49 77.98,7.49 77.98,1.14 78.61,0.51 78.61,-0.13 98.3,-0.13 98.93,0.51 98.93,1.14 98.93,2.41 101.47,4.95 101.47,5.59 101.47,37.97 98.93,40.51 98.93,51.31 97.03,53.21 20.83,53.21 19.56,51.94 19.56,51.31 19.56,50.67
PGND
  Top 0.152: R10.2 R11.2 23.64,14.75 24.26,15.37 C26.1 25.34,16.38 24.43,17.28 24.43,18.97 26.26,20.8 27.62,20.8 28.09,21.28 30.27,21.28 32.36,23.37 33.15,23.37 33.33,23.55 33.33,31.7 32.89,32.13 32.89,35.6 R21.2 | C31.1 24.54,9.49 23.64,10.4 R10.2 | R10.2 22.16,11.44 C32.2 22.03,10.84 19.58,8.38 9.52,8.38 6.86,11.05 J2.1
REF_ELEC
  Top 0.152: R25.1 26.57,18.38 C62.1 27.3,17.65 28.66,17.65 IC8.3
REF_ELEC_CON
  Top 0.15: C35.1 21.82,17.08 | 13.84,9.05 10.4,9.05 7.87,11.58 7.87,13.21
  Top 0.152: C35.1 22.23,18.38 R25.2 | J3.1 6.86,18.26 7.87,17.24 7.87,13.21 | 21.82,17.08 21.82,16.74 20.19,15.11 20.19,10.67 18.57,9.05 13.84,9.05
SPI2_CS
  Bottom 0.15: 82.42,49.4 85.58,49.4 87.15,47.83 95.42,47.83 97.92,45.34 97.92,7.11 97.24,6.44 R12.1
  Bottom 0.152: JP20.2 22.48,49.4 82.42,49.4
SPI2_MISO
  Bottom 0.15: R16.1 63.76,3.48 62.93,3.48 61.87,2.41 JP25.5
SPI2_MOSI
  Bottom 0.15: R14.1 71.21,2.63 69.93,1.35 56.82,1.35 JP25.3
SPI2_SCK
  Bottom 0.15: JP22.7 84.73,50.67 85.79,49.61 86.03,49.61 87.5,48.13 95.76,48.13 98.3,45.59 98.3,7.07 97.37,6.14 85.09,6.14 R13.1
SPI_CLK  (via drill 0.35)
  Top 0.15: v46.86,26.27 46.24,26.89 46.24,27.01 45.94,27.32 45.5,27.32 45.46,27.28 IC1.40 | J1.5 57.96,24.06 53.47,19.57 v53.47,19.5
  Bottom 0.15: U2.7 53.47,12.34 v53.47,19.5 53.47,19.89 47.09,26.27 v46.86,26.27
SPI_IN  (via drill 0.35)
  Top 0.15: v46.23,24.26 44.08,24.26 IC1.34 | J1.6 56.71,24.82 52.72,20.83 v52.72,19.56
  Bottom 0.15: U2.6 52.9,19.36 | 52.9,19.36 48.01,24.26 v46.23,24.26 | v52.72,19.56 52.9,19.38 52.9,19.36
SPI_OUT  (via drill 0.35)
  Top 0.15: IC1.43 44.13,28.7 v45.59,28.7 47.05,27.25 52.21,27.25 52.34,27.11 52.34,25.63 52.47,25.5 53.46,25.5 53.59,25.63 53.59,25.75 J1.8
  Bottom 0.15: U2.4 51.6,18.14 45.2,24.55 45.2,27.01 45.59,27.41 v45.59,28.7
SRB1
  Top 0.152: IC8.4 29.55,19.37 IC8.1 29.68,20.19 32.26,20.19 33.75,21.68 IC1.17
SRB2
  Top 0.15: IC1.18 34.96,23.54 35.34,23.93 40.92,23.93 42.26,22.59 47.93,22.59 J1.10
START  (via drill 0.35)
  Top 0.15: J1.7 55.46,25.62 54.07,24.23 53.44,24.23 v49.88,20.67 | v47.13,23.37 46.75,23.75 46.75,24.47 44.94,26.28 IC1.38
  Bottom 0.15: U2.5 52.25,18.3 v49.88,20.67 47.18,23.37 v47.13,23.37
START_D68
  Bottom 0.152: R15.1 JP24.2
VCC_5V
  Top 0.254: C28.1 58.03,19.56 58.17,19.56 58.17,21.16 61.71,24.71 | J1.2 61.71,24.71 | C27.1 68.02,27.18 | 61.71,24.71 65.55,24.71 68.02,27.18 | 68.02,27.18 68.02,31.05 L4.1
  Top 0.508: C28.1 57.94,19.47 71.41,19.47 71.98,20.04 U1.5 71.98,19.71 76.97,14.72 ISO1.7
VCC_5V_FILTERED
  Top 0.15: 57.41,36.59 57.13,36.87 57.13,38.19 57.43,38.49 U4.3 | U3.3 58.52,42.42 57.4,42.42 57.02,42.04 57.02,40.89 57.37,40.55 U3.1
  Top 0.152: U4.1 57.41,36.59
  Top 0.254: 63.04,35.99 63,36.03 C68.1 59.13,36.03 U4.1 | 63.04,35.99 C64.1 C65.1 60.37,40.55 U3.1 | 63.04,35.99 63.04,34.72 C1.1 65.84,32.96 L4.2
VCC_MCU  (via drill 0.35)
  Top 0.508: L1.1 49.29,5.46 v49.02,5.73 42.56,5.73 42.28,5.45 C2.1 40.37,4.81 JP26.5
  Bottom 0.15: U2.20 49.19,5.73 v49.02,5.73
  Bottom 0.152: C67.1 U2.20
VREFP
  Top 0.15: IC1.24 37.97,21.66 37.97,20.19 37.39,19.61 C23.1 37.39,16.96 C22.1 37.37,15.3 TP4.1

## Text on the board
Top: Layer 1 / Top sig.
AGND: Layer 2 / GND (-)
AVDD: Layer 3 / AVDD
Bottom: Layer 4 / Bottom sig.
tPlace: SCL1 | SDA1 | AREF | GND | 13 | 12 | 11 | 10 | 9 | 8 | 7 | 6 | 5 | 4 | 3 | 2 | 1 | 14 | 15 | 16 | 17 | 18 | 19 | 20 | 21 | VREFP | 5V | VIN | IOREF | RESET | 3V3 | A0 | A1 | A2 | A3 | A4 | A5 | A6 | A7 | A8 | A9 | A10 | A11 | DAC / 0 | DAC / 1 | CAN / RX | CAN / TX | GND | GND
tNames: PWDN | CS | SCK | Design: / Frodo Muijzer / Review: / Martijn Schouten | CH5 | UNIVERSITY OF TWENTE. | DVDD 3V3 | U3 | CH4 | AVDD 3V3 | CH6 | U4 | INT - EXT | CLKSEL | CH3 | CH7 | SRB2 / DRDY / S_OUT / START / S_IN / S_CLK / S_CS / CLK / 5V / AGND | ADS1299IPAG | U1 | R1SE-0505-R | REF_ELEC | AM1DM-0505SH60-NZ | CH2 | Blue Casing to / indicate REF | REF | PGND | ISO | Only one isolator / is required! | CH8 | VREF | AVDD | Green Casing to / indicate PGND | CH1 | PGND | AGND | MCU | Ver: 20230721 | GPIO4 | BioRobotics EMG Shield | Based upon / hackeeg-shield rev 1.5.0 / by Adam Feuer | V_IN | MOSI | MISO | DRDY | START
bNames: CS | SCK | SCK | CH4 / N P | P N / CH5 | CH3 / N P | P N / CH6 | CH2 / N P | REF / ELEC | P N / CH7 | SJ1-3535NG-BE | Optional: / R2 = SPI_CS Pull-up | MCU Powered | ISOLATED | CH1 / N P | 5V_IN | PE_GND | AGND | VCC_5V | PGND | START | SJ1-3535NG-GR | MISO | P N / CH8 | VREF / / / AVDD / / / AGND | U2 / SPI ISOLATOR | MOSI | DRDY | DRDY | CS | SCK | V_IN | PE_GND | MOSI | MISO | DRDY | START